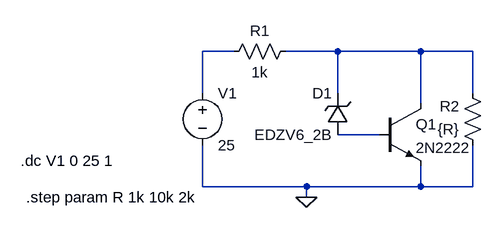
[diagram p0: schematic shuntvoltage.asc]
shuntvoltage.asc, the LTspice schematic file:
Version 4
SHEET 1 880 680
WIRE 112 80 64 80
WIRE 272 80 192 80
WIRE 400 80 272 80
WIRE 480 80 400 80
WIRE 64 144 64 80
WIRE 272 144 272 80
WIRE 480 144 480 80
WIRE 400 160 400 80
WIRE 336 208 272 208
WIRE 64 288 64 224
WIRE 224 288 64 288
WIRE 400 288 400 256
WIRE 400 288 224 288
WIRE 480 288 480 224
WIRE 480 288 400 288
WIRE 224 304 224 288
FLAG 224 304 0
SYMBOL voltage 64 128 R0
WINDOW 123 0 0 Left 0
WINDOW 39 0 0 Left 0
SYMATTR InstName V1
SYMATTR Value 25
SYMBOL res 208 64 R90
WINDOW 0 0 56 VBottom 2
WINDOW 3 32 56 VTop 2
SYMATTR InstName R1
SYMATTR Value 1k
SYMBOL res 496 240 R180
WINDOW 0 36 76 Left 2
WINDOW 3 36 40 Left 2
SYMATTR InstName R2
SYMATTR Value {R}
SYMBOL zener 288 208 R180
WINDOW 0 24 64 Left 2
WINDOW 3 24 0 Left 2
SYMATTR InstName D1
SYMATTR Value EDZV6_2B
SYMBOL npn 336 160 R0
SYMATTR InstName Q1
SYMATTR Value 2N2222
TEXT -216 248 Left 2 !.dc V1 0 25 1
TEXT -208 304 Left 2 !.step param R 1k 10k 2k

The netlist it stands for:
* shuntvoltage.asc
V1 N001 0 25
R1 N002 N001 1k
R2 0 N002 {R}
D1 N003 N002 EDZV6_2B
Q1 N002 N003 0 0 2N2222
.model D D
.lib standard.dio
.model NPN NPN
.model PNP PNP
.lib standard.bjt
.dc V1 0 25 1
.step param R 1k 10k 2k
.backanno
.end